# EAGLE design Servo8 (EAGLE 7.6.0)

## Sheet 1 of 2: Adafruit 12-bit 16 channel pwm controller
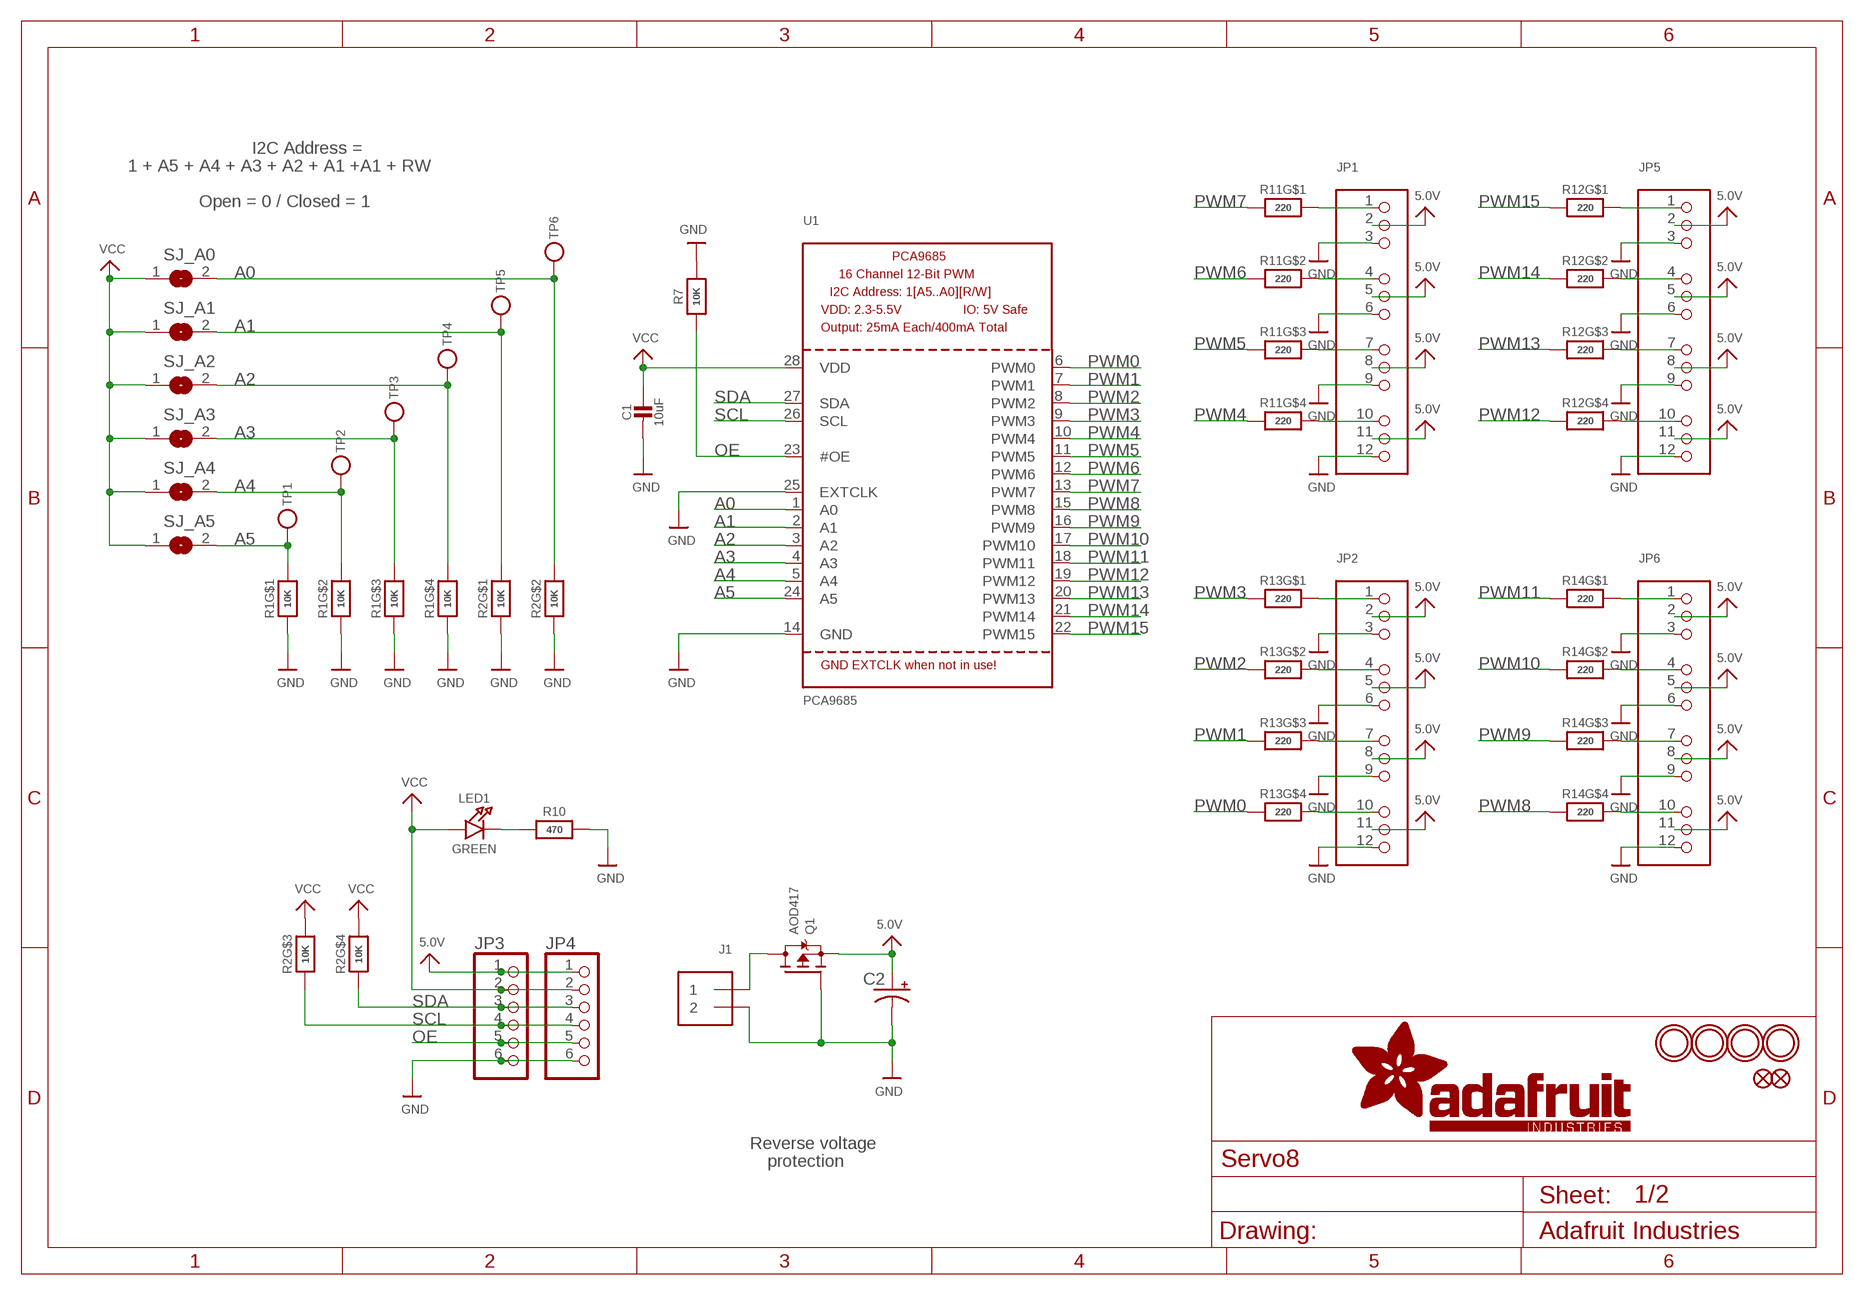
[diagram p0: schematic, sheet 1]

### Parts
C1  10uF  CAP_CERAMIC0805-NOOUTLINE  [0805-NO]
C2  CPOL-USE3.5-8  [E3,5-8]
FID1  FIDUCIAL""  [FIDUCIAL_1MM]
FID2  FIDUCIAL""  [FIDUCIAL_1MM]
J1  TERMBLOCK_1X2  [TERMBLOCK_1X2-3.5MM]
JP1  HEADER-3X04  [3X04]
JP2  HEADER-3X04  [3X04]
JP3  PINHD-1X6CB  [1X06-CLEANBIG]
JP4  PINHD-1X6CB  [1X06-CLEANBIG]
JP5  HEADER-3X04  [3X04]
JP6  HEADER-3X04  [3X04]
LED1  GREEN  LED0805_NOOUTLINE  [CHIPLED_0805_NOOUTLINE]
Q1  AOD417  MOSFET-PTO252  [TO252]
R1  10K  RESISTOR_4PACK  [RESPACK_4X0603]
R2  10K  RESISTOR_4PACK  [RESPACK_4X0603]
R7  10K  RESISTOR0805_NOOUTLINE  [0805-NO]
R10  470  RESISTOR_0805MP  [_0805MP]
R11  220  RESISTOR_4PACK  [RESPACK_4X0603]
R12  220  RESISTOR_4PACK  [RESPACK_4X0603]
R13  220  RESISTOR_4PACK  [RESPACK_4X0603]
R14  220  RESISTOR_4PACK  [RESPACK_4X0603]
SJ_A0  SOLDERJUMPERREFLOW_NOPASTE  [SOLDERJUMPER_REFLOW_NOPASTE]
SJ_A1  SOLDERJUMPERREFLOW_NOPASTE  [SOLDERJUMPER_REFLOW_NOPASTE]
SJ_A2  SOLDERJUMPERREFLOW_NOPASTE  [SOLDERJUMPER_REFLOW_NOPASTE]
SJ_A3  SOLDERJUMPERREFLOW_NOPASTE  [SOLDERJUMPER_REFLOW_NOPASTE]
SJ_A4  SOLDERJUMPERREFLOW_NOPASTE  [SOLDERJUMPER_REFLOW_NOPASTE]
SJ_A5  SOLDERJUMPERREFLOW_NOPASTE  [SOLDERJUMPER_REFLOW_NOPASTE]
TP1  TESTPOINTROUND1MM  [TESTPOINT_ROUND_1MM]
TP2  TESTPOINTROUND1MM  [TESTPOINT_ROUND_1MM]
TP3  TESTPOINTROUND1MM  [TESTPOINT_ROUND_1MM]
TP4  TESTPOINTROUND1MM  [TESTPOINT_ROUND_1MM]
TP5  TESTPOINTROUND1MM  [TESTPOINT_ROUND_1MM]
TP6  TESTPOINTROUND1MM  [TESTPOINT_ROUND_1MM]
U1  PCA9685  [TSSOP28]
U$47  MOUNTINGHOLE2.5  [MOUNTINGHOLE_2.5_PLATED]
U$48  MOUNTINGHOLE2.5  [MOUNTINGHOLE_2.5_PLATED]
U$49  MOUNTINGHOLE2.5  [MOUNTINGHOLE_2.5_PLATED]
U$50  MOUNTINGHOLE2.5  [MOUNTINGHOLE_2.5_PLATED]

### Nets
5.0V: C2.+ JP1.2 JP1.5 JP1.8 JP1.11 JP2.2 JP2.5 JP2.8 JP2.11 JP3.1 JP4.1 JP5.2 JP5.5 JP5.8 JP5.11 JP6.2 JP6.5 JP6.8 JP6.11 Q1.2(S) ; also sheet 2
A0: R2.7 SJ_A0.2 TP6.P$1 U1.1(A0)
A1: R2.8 SJ_A1.2 TP5.P$1 U1.2(A1)
A2: R1.5 SJ_A2.2 TP4.P$1 U1.3(A2)
A3: R1.6 SJ_A3.2 TP3.P$1 U1.4(A3)
A4: R1.7 SJ_A4.2 TP2.P$1 U1.5(A4)
A5: R1.8 SJ_A5.2 TP1.P$1 U1.24(A5)
GND: C1.2 C2.- J1.2 JP1.3 JP1.6 JP1.9 JP1.12 JP2.3 JP2.6 JP2.9 JP2.12 JP3.6 JP4.6 JP5.3 JP5.6 JP5.9 JP5.12 JP6.3 JP6.6 JP6.9 JP6.12 Q1.1(G) R1.1 R1.2 R1.3 R1.4 R2.1 R2.2 R7.2 R10.2 U1.14(GND) U1.25(EXTCLK) ; also sheet 2
N$1: LED1.C R10.1
N$2: JP1.4 R11.7
N$3: JP1.1 R11.8
N$4: JP1.7 R11.6
N$5: JP1.10 R11.5
N$6: JP2.1 R13.8
N$7: JP2.4 R13.7
N$8: JP2.7 R13.6
N$9: JP2.10 R13.5
N$10: JP6.10 R14.5
N$11: JP6.7 R14.6
N$12: JP6.4 R14.7
N$13: JP6.1 R14.8
N$14: JP5.10 R12.5
N$15: JP5.7 R12.6
N$16: JP5.4 R12.7
N$17: JP5.1 R12.8
OE: JP3.5 JP4.5 R7.1 U1.23(#OE)
PWM0: R13.4 U1.6(PWM0)
PWM1: R13.3 U1.7(PWM1) ; also sheet 2
PWM2: R13.2 U1.8(PWM2) ; also sheet 2
PWM3: R13.1 U1.9(PWM3) ; also sheet 2
PWM4: R11.4 U1.10(PWM4) ; also sheet 2
PWM5: R11.3 U1.11(PWM5) ; also sheet 2
PWM6: R11.2 U1.12(PWM6) ; also sheet 2
PWM7: R11.1 U1.13(PWM7) ; also sheet 2
PWM8: R14.4 U1.15(PWM8) ; also sheet 2
PWM9: R14.3 U1.16(PWM9)
PWM10: R14.2 U1.17(PWM10)
PWM11: R14.1 U1.18(PWM11)
PWM12: R12.4 U1.19(PWM12)
PWM13: R12.3 U1.20(PWM13)
PWM14: R12.2 U1.21(PWM14)
PWM15: R12.1 U1.22(PWM15)
PWRIN: J1.1 Q1.3(D)
SCL: JP3.4 JP4.4 R2.3 U1.26(SCL) ; also sheet 2
SDA: JP3.3 JP4.3 R2.4 U1.27(SDA) ; also sheet 2
VCC: C1.1 JP3.2 JP4.2 LED1.A R2.5 R2.6 SJ_A0.1 SJ_A1.1 SJ_A2.1 SJ_A3.1 SJ_A4.1 SJ_A5.1 U1.28(VDD) ; also sheet 2

### Notes on the sheet
- I2C Address =
- 1 + A5 + A4 + A3 + A2 + A1 +A1 + RW
- Open = 0 / Closed = 1
- Reverse voltage
- protection

## Sheet 2 of 2
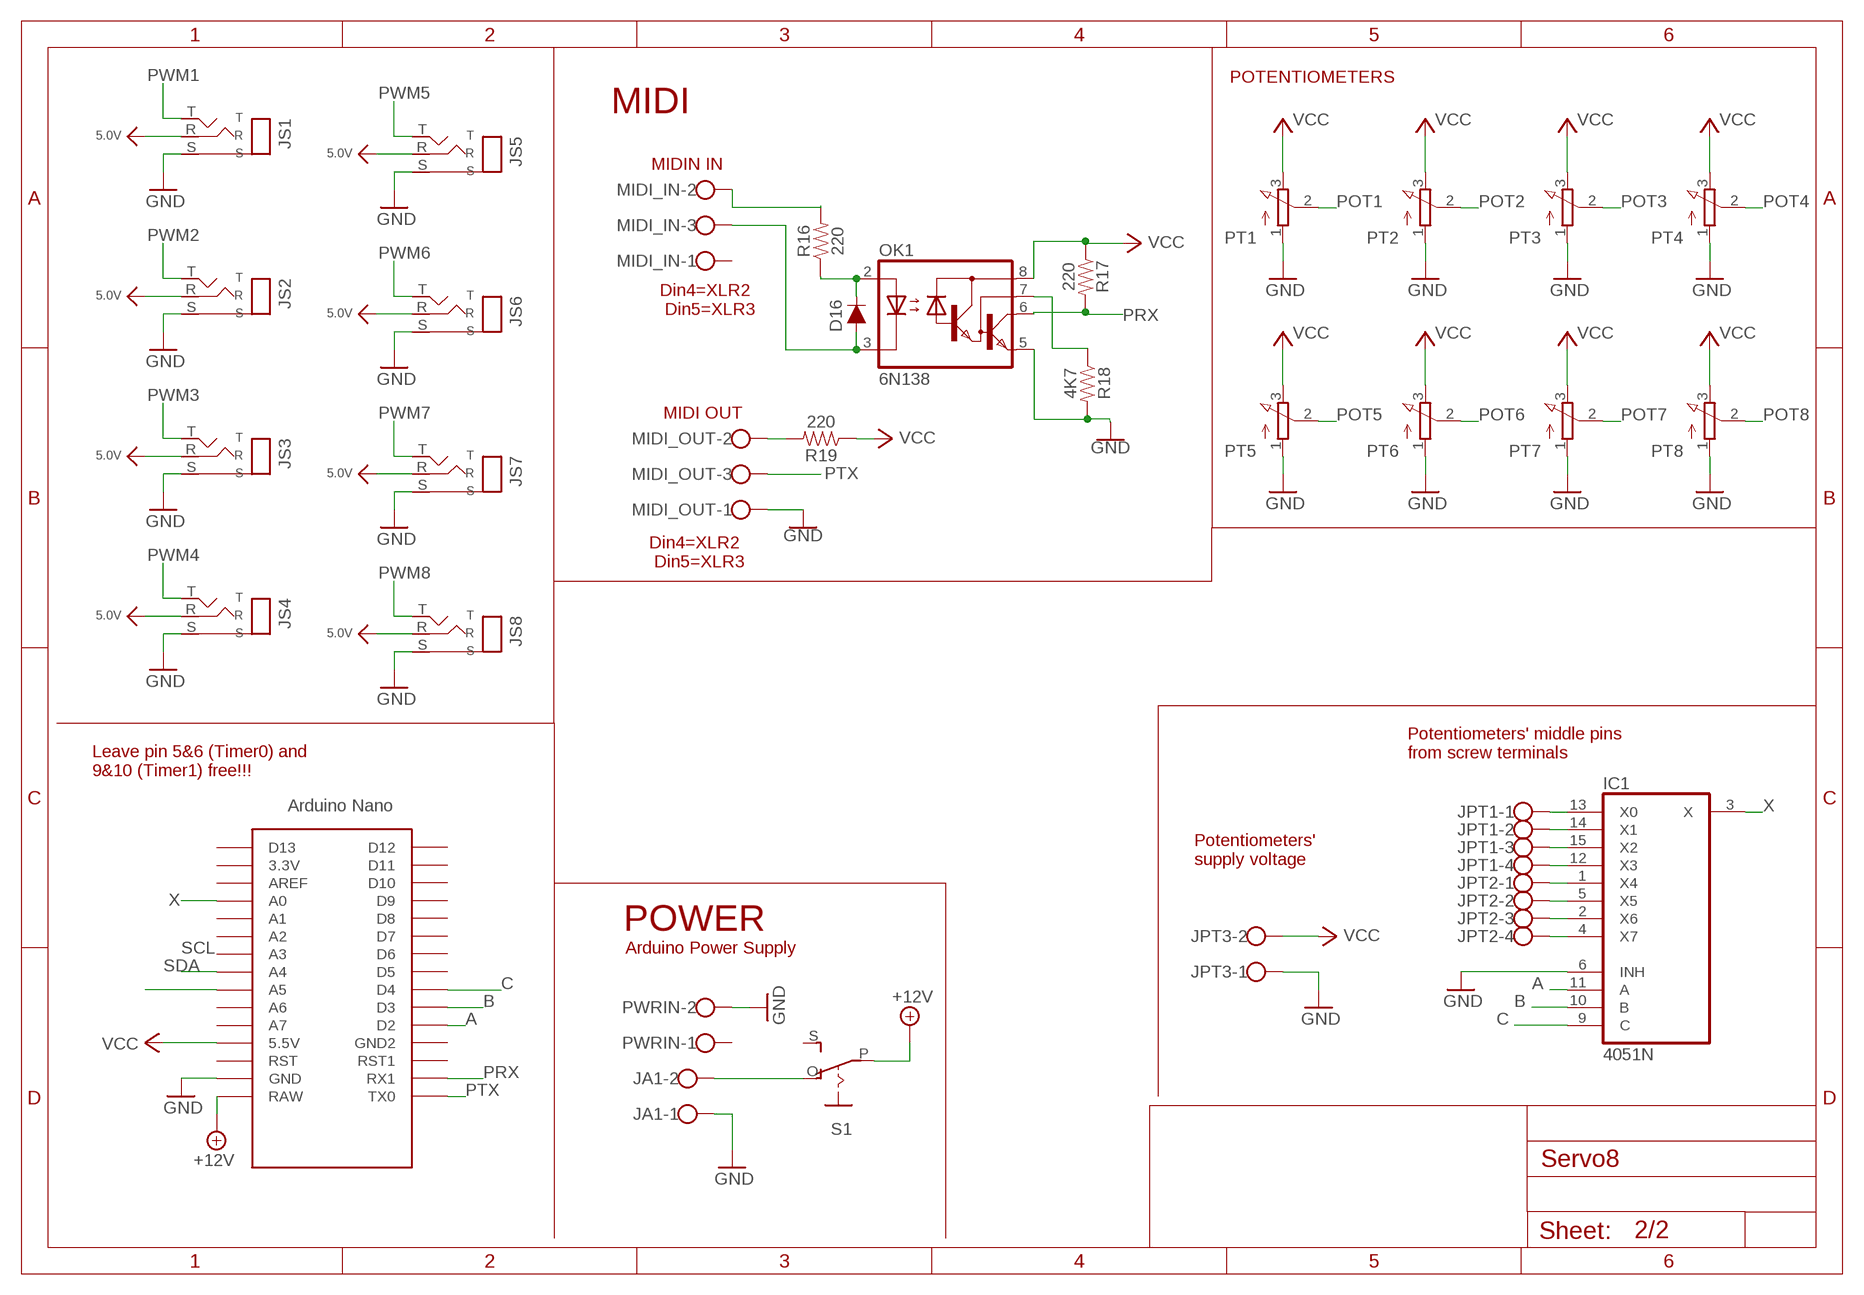
[diagram p1: schematic, sheet 2]

### Parts
D16  200mA/100V/1V  DIODE-1N4148  [DIODE-1N4148]
IC1  4051N  [DIL16]
JA1  W237-102  [W237-102]
JPT1  W237-4  [W237-4]
JPT2  W237-4  [W237-4]
JPT3  W237-102  [W237-102]
JS1  STEREOREV  [STEREO_JACK_MIRROR]
JS2  STEREOREV  [STEREO_JACK_MIRROR]
JS3  STEREOREV  [STEREO_JACK_MIRROR]
JS4  STEREOREV  [STEREO_JACK_MIRROR]
JS5  STEREOREV  [STEREO_JACK_MIRROR]
JS6  STEREOREV  [STEREO_JACK_MIRROR]
JS7  STEREOREV  [STEREO_JACK_MIRROR]
JS8  STEREOREV  [STEREO_JACK_MIRROR]
MIDI_IN  W237-103  [W237-103]
MIDI_OUT  W237-103  [W237-103]
OK1  6N138  [DIL08]
PT1  3RP/1610N  [3RP/1610N]
PT2  3RP/1610N  [3RP/1610N]
PT3  3RP/1610N  [3RP/1610N]
PT4  3RP/1610N  [3RP/1610N]
PT5  3RP/1610N  [3RP/1610N]
PT6  3RP/1610N  [3RP/1610N]
PT7  3RP/1610N  [3RP/1610N]
PT8  3RP/1610N  [3RP/1610N]
PWRIN  W237-4  [W237-4]
R16  220  1KOHM-HORIZ-1/4W-5%  [AXIAL-0.3]
R17  220  1KOHM-HORIZ-1/4W-5%  [AXIAL-0.3]
R18  4K7  1KOHM-HORIZ-1/4W-5%  [AXIAL-0.3]
R19  220  1KOHM-HORIZ-1/4W-5%  [AXIAL-0.3]
S1  EG1218S  [EG1218]
U$55  NANO  [NANO]

### Nets
5.0V: JS1.R JS2.R JS3.R JS4.R JS5.R JS6.R JS7.R JS8.R ; also sheet 1
+12V: S1.P U$55.RAW
A: IC1.11(A) U$55.D2
B: IC1.10(B) U$55.D3
C: IC1.9(C) U$55.D4
GND: IC1.6(INH) JA1.1 JPT3.1 JS1.S JS2.S JS3.S JS4.S JS5.S JS6.S JS7.S JS8.S MIDI_OUT.1 OK1.5(GND) PT1.1(A) PT2.1(A) PT3.1(A) PT4.1(A) PT5.1(A) PT6.1(A) PT7.1(A) PT8.1(A) PWRIN.2 R18.P$2 U$55.GND ; also sheet 1
N$18: JA1.2 S1.O
N$19: MIDI_OUT.2 R19.P$2
N$25: D16.A MIDI_IN.3 OK1.3(C)
N$26: D16.C OK1.2(A) R16.P$1
N$27: MIDI_IN.2 R16.P$2
N$29: OK1.7(VB) R18.P$1
POT1: IC1.13(X0) JPT1.1 PT1.2(S)
POT2: IC1.14(X1) JPT1.2 PT2.2(S)
POT3: IC1.15(X2) JPT1.3 PT3.2(S)
POT4: IC1.12(X3) JPT1.4 PT4.2(S)
POT5: IC1.1(X4) JPT2.1 PT5.2(S)
POT6: IC1.5(X5) JPT2.2 PT6.2(S)
POT7: IC1.2(X6) JPT2.3 PT7.2(S)
POT8: IC1.4(X7) JPT2.4 PT8.2(S)
PRX: OK1.6(VO) R17.P$2 U$55.RX1
PTX: MIDI_OUT.3 U$55.TX0
PWM1: JS1.T ; also sheet 1
PWM2: JS2.T ; also sheet 1
PWM3: JS3.T ; also sheet 1
PWM4: JS4.T ; also sheet 1
PWM5: JS5.T ; also sheet 1
PWM6: JS6.T ; also sheet 1
PWM7: JS7.T ; also sheet 1
PWM8: JS8.T ; also sheet 1
SCL: U$55.A5 ; also sheet 1
SDA: U$55.A4 ; also sheet 1
VCC: JPT3.2 OK1.8(VCC) PT1.3(E) PT2.3(E) PT3.3(E) PT4.3(E) PT5.3(E) PT6.3(E) PT7.3(E) PT8.3(E) R17.P$1 R19.P$1 U$55.5V(5.5V) ; also sheet 1
X: IC1.3(X) U$55.A0
Unconnected: MIDI_IN.1 PWRIN.1 PWRIN.3 PWRIN.4 S1.S U$55.3.3V U$55.A1 U$55.A2 U$55.A3 U$55.A6 U$55.A7 U$55.AREF U$55.D5 U$55.D6 U$55.D7 U$55.D8 U$55.D9 U$55.D10 U$55.D11 U$55.D12 U$55.D13 U$55.GND1(GND2) U$55.ICSP1 U$55.ICSP2 U$55.ICSP3 U$55.ICSP4 U$55.ICSP5 U$55.ICSP6 U$55.RST U$55.RST1

### Notes on the sheet
- POTENTIOMETERS
- MIDI
- MIDIN IN
- Din4=XLR2 
  Din5=XLR3
- MIDI OUT
- Din4=XLR2 
  Din5=XLR3
- Potentiometers' middle pins 
  from screw terminals
- Leave pin 5&6 (Timer0) and 
  9&10 (Timer1) free!!!
- Potentiometers' 
  supply voltage
- POWER
- Arduino Power Supply

## Power pins joined to a net without a drawn wire
GND: IC1.8(GND)
VCC: IC1.16(VCC)
VEE: IC1.7(VEE)

## Library data of the parts
C1 = microbuilder:CAP_CERAMIC: Ceramic Capacitors For new designs, use the packages preceded by an '_' character since they are more reliable: The following footprints should be used on most boards: _0402 - Standard footprint for regular board layouts _0603 - Standard footprint for regular board layouts _0805 - Standard footprint for regular board layouts _1206 - Standard footprint for regular board layouts For extremely tight-pitch boards where space is at a premium, the following 'micro-pitch' footprints can be used (smaller pads, no silkscreen outline, etc.): _0402MP - Micro-pitch footprint for very dense/compact boards _0603MP - Micro-pitch footprint for very dense/compact boards _0805MP - Micro-pitch footprint for very dense/compact boards _1206MP - Micro-pitch footprint for very dense/compact boards
C2 = adafruit:CPOL-US: POLARIZED CAPACITOR, American symbol
D16 = SparkFun-DiscreteSemi:DIODE: Diode These are standard reverse protection diodes and small signal diodes. SparkFun Products: SparkFun SparkPunk Sound Kit <https://www.sparkfun.com/products/11177> SparkFun ESP8266 Thing <https://www.sparkfun.com/products/13231>; PROD_ID: DIO-08378
FID1 FID2 = microbuilder:FIDUCIAL: Fiducial Alignment Points Various fiducial points for machine vision alignment.; BOM: EXCLUDE
IC1 = 40xx:4051: 8-channel ANALOG MULTIPLEXER
J1 = microbuilder:TERMBLOCK_1X2: 3.5mm Terminal block http://www.ladyada.net/library/pcb/eaglelibrary.html
JA1 JPT3 = con-wago-500:W237-102: WAGO SCREW CLAMP; MPN: 237-102; OC_FARNELL: unknown; OC_NEWARK: 70K9898
JP1 JP2 JP5 JP6 = microbuilder:HEADER-3X04
JP3 JP4 = adafruit:PINHD-1X6: PIN HEADER
JPT1 JPT2 PWRIN = con-wago-500:W237-4: WAGO SCREW CLAMP; OC_FARNELL: unknown; OC_NEWARK: unknown
JS1-JS8 = gm-jacks:STEREO: Stereo (TRS) 1/4" Phone Jack often use for the input jack to disconnect battery when there is no plug in the jack also called TRS or tip-ring-sleeve jack
LED1 = microbuilder:LED: LED 0603 - 0603 Surface Mount Package 2mA: Green LED - Low Power (3.9mcd, 2ma, 1.7Vf) - Digikey: 475-2709-2-ND Orange LED - Low Power (9.8mcd, 2ma, 1.8Vf) - Digikey: 475-1194-2-ND Red LED - Low Power (5mcd, 2ma, 1.8Vf) - Digikey: 475-1195-2-ND Yellow LED - Low Power (7mcd, 2ma, 1.8Vf) - Digikey: 475-1196-2-ND 5mA: Blue LED - Low Power (17mcd, 5ma, 2.9Vf) - Digikey: LNJ937W8CRACT-ND 0805 - 0805 Surface Mount Package 2mA: Red LED (8.8mcd, 2mA, 1.8Vf, Clear) - Low Power [Digikey: 475-2510-1-ND] Green LED (5mcd, 2mA, 1.8Vf, Clear) - Low Power [Digikey: 475-2730-1-ND] Yellow LED (11.3mcd, 2mA, 1.8Vf, Clear) - Low Power [Digikey: 475-2555-1-ND] 20mA: Red LED (104mcd, 20mA, Diffused) - LS R976 [Digikey: 475-1278-6-ND] Red LED (12mcd, 20mA, 2.0Vf, Clear) - APT2012EC [Digikey: 754-1128-1-ND] Green LED (15mcd, 20mA, 2.2Vf, Clear) - APT2012GC [Digikey: 754-1131-1-ND] Orange LED (160mcd, 20mA, 2.1Vf, Clear) - APT2012SECK [Digikey: 754-1130-1-ND] 1206 - 1206 Surface Mount Package Green LED (26mcd, 20mA, Diffused) - LG N971 [Digikey: 475-1407-6-ND] Red LED (15mcd, 20mA, Diffused) - LH N974 [Digikey: 475-1416-6-ND] Cree - Cree High-Power Surface Mount LEDs XPEBWT-L1-0000-00D50 - White 111lm 350mA 2.9Vf 6200K 110° XTEAWT-00-0000-00000LEE3 - White 114lm 350mA 2.85Vf 5000K 115° Everlight - Everlight 45-21 Series Surface Mount LEDs 45-21/QK2C-B2832AC2CB2/2T - Warm White 2000mcd 20mA 3.25Vf 3050K 120° 45-21/LK2C-B38452C4CB2/2T - Nuetral White 2000mcd 20mA 3.25Vf 4150K 120° 45-21/LK2C-B50634C6CB2/2T - Cold White 2200mcd 20mA 3.25Vf 5650K 120° PLCC2 Reverse Mount LS T77K-J1L2-1-0-2-R18-Z - Red 11.25mcd 2mA 1.8Vf 630nm 120° LO T77K-L1M2-24-Z - Orange 19.6mcd 2mA 1.8Vf 606nm 120° LY T77K-K2M1-26-Z - Yellow 15.7mcd 2mA 1.8Vf 587nm 120°
MIDI_IN MIDI_OUT = con-wago-500:W237-103: WAGO SCREW CLAMP; MPN: 237-103; OC_FARNELL: unknown; OC_NEWARK: 18M7116
OK1 = optocoupler:6N138: MOTOROLA OPTO COUPLER; MF: VISHAY/TELEFUNKEN; MPN: 6N138; OC_FARNELL: 9860150; OC_NEWARK: 35K5294
PT1-PT8 = pot:3RP/1610N: 16mm Potentiometer one level Source: http://www.alphapotentiometers.net/html/16mm_pot_2.html
Q1 = microbuilder:MOSFET-P: P-Channel Mosfet LEGEND VDS: Voltage Drain-Source ID: Drain Current RDS(ON): Drain-Source On-State Resistance VGS(TH): Gate-Source Threshold Voltage CISS: Drain-Source Input Capacitance SOT-23 Name VDS ID RDS(ON) VGS(TH) CISS Order Number IRLML5103 30V 760mA 600 mOhm -- 75pF @ 25V Digikey: IRLML5103PBFCT-ND IRLML6401 12V 4.3A 50 mOhm 950mV @ 250µA 830pF @ 10V Digikey: IRLML6401PBFTR-ND NTR0202PL 20V 400mA 800 mOhm 2.3V @ 250uA 70pF @ 5V Digikey: NTR0202PLT1GOSTR-ND NTR4101PT1G 20V 1.8A 85 mOhm 1.2V @ 250uA 675pF @ 10V Digikey: NTR4101PT1GOSCT-ND DMP2004K 20V 600mA 900 mOhm 1V @ 250uA 175pF @ 16V Digikey: DMP2004KDICT-ND PMV65XP 20V 3.9A 76 mOhm 950mV @ 1mA 725pF @ 20V Digikey: 568-2358-2-ND TO-252 Name VDS ID RDS(ON) VGS(TH) CISS Order Number AOD417 30V 25A 34 mOhm 3V @ 250µA 920pF @ 15V Digikey: 785-1106-2-ND
R1 R2 R11-R14 = microbuilder:RESISTOR_4PACK: Resistor Packs (4 resistors) 4 x 0603 10K 1/16W - Digikey: YC164J-10KCT-ND
R7 R10 = microbuilder:RESISTOR: Resistors For new designs, use the packages preceded by an '_' character since they are more reliable: The following footprints should be used on most boards: _0402 - Standard footprint for regular board layouts _0603 - Standard footprint for regular board layouts _0805 - Standard footprint for regular board layouts _1206 - Standard footprint for regular board layouts For extremely tight-pitch boards where space is at a premium, the following 'micro-pitch' footprints can be used (smaller pads, no silkscreen outline, etc.): _0402MP - Micro-pitch footprint for very dense/compact boards _0603MP - Micro-pitch footprint for very dense/compact boards _0805MP - Micro-pitch footprint for very dense/compact boards _1206MP - Micro-pitch footprint for very dense/compact boards
R16-R19 = SparkFun-Resistors:1KOHM: 1kΩ resistor A resistor is a passive two-terminal electrical component that implements electrical resistance as a circuit element. Resistors act to reduce current flow, and, at the same time, act to lower voltage levels within circuits. - Wikipedia; PROD_ID: RES-08380; VALUE: 1k
S1 = adafruit:EG1218: SLIDING SWITCH 0.1" spacing through hole, vertical SPDT slide switch http://www.ladyada.net/library/pcb/eaglelibrary.html
SJ_A0 SJ_A1-SJ_A5 = microbuilder:SOLDERJUMPER: SMD Solder JUMPER Solder the two pads together to create a connection, or remove the solder to break it. REFLOW - Use this footprint for solder paste and reflow ovens. WAVE - Use this footprint for hand-soldering (larger pads). CLOSED - Has a trace between the two pads to ensure it is closed by default. The trace needs to be cut to disable the jumper, and can be closed again by creating a solder bridge between the two pads.
TP1-TP6 = microbuilder:TESTPOINT: Test Point Various test points for characterisation and PCB testing TESTPOINT_SMT - Compact Surface Mount Test Point [Digikey: 5016KTR-ND]
U1 = microbuilder:PCA9685: PCA9685 - 16 Channel 12-Bit I2C PWM Controller 5.0V tolerant 16 channel, 12-bit I2C PWM controller with 25mA per output (max. 400mA total) Digikey: 568-5931-1-ND
U$47-U$50 = microbuilder:MOUNTINGHOLE: Mounting Hole For #2 screws (0.086"/2.18mm width, 0.094"/2.4mm hole) use 2.5mm; BOM: EXCLUDE
U$55 = Arduino-clone:NANO: Arduino Nano

## Net classes
0 default: width 0.508 mm, drill 0.508 mm, clearance 0.406 mm
1 GND: width 1.016 mm, drill 0.508 mm, clearance 0.508 mm
2 5VM: width 1.016 mm, drill 0.508 mm, clearance 0.508 mm
3 12VL: width 0.61 mm, drill 0.508 mm, clearance 0.508 mm
4 12VA: width 0.508 mm, drill 0.508 mm, clearance 0.508 mm

## Board
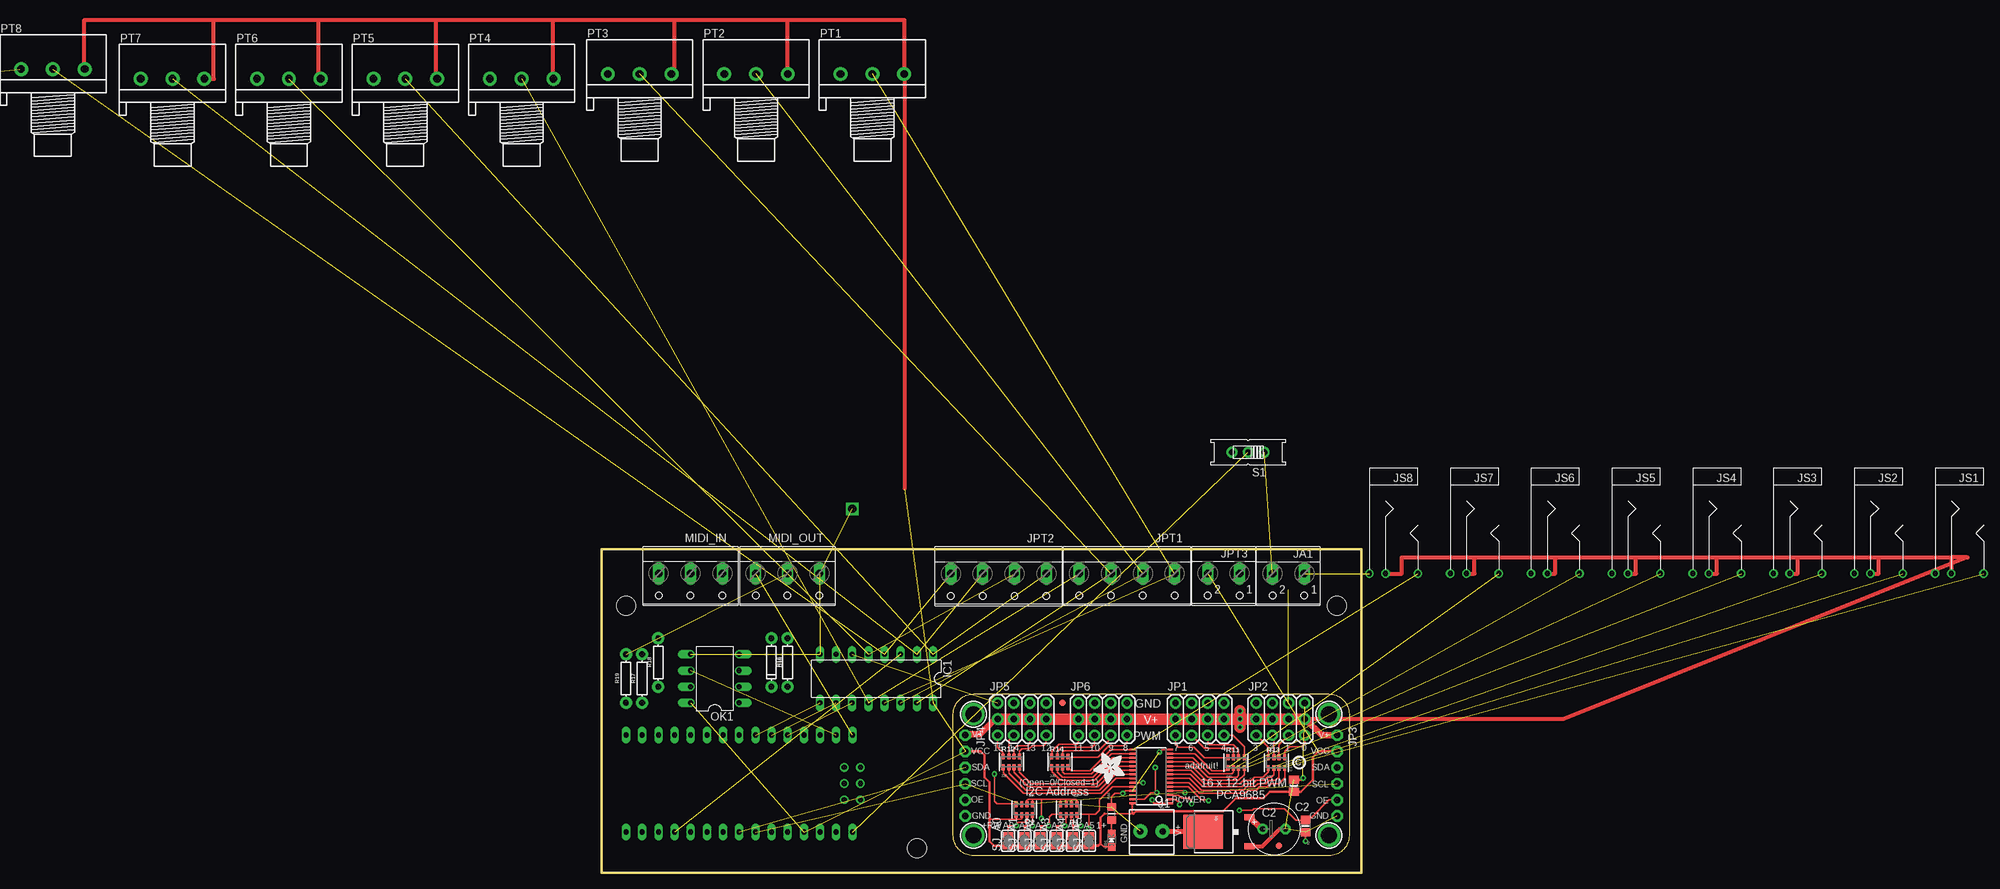
[diagram p2: board, top side]
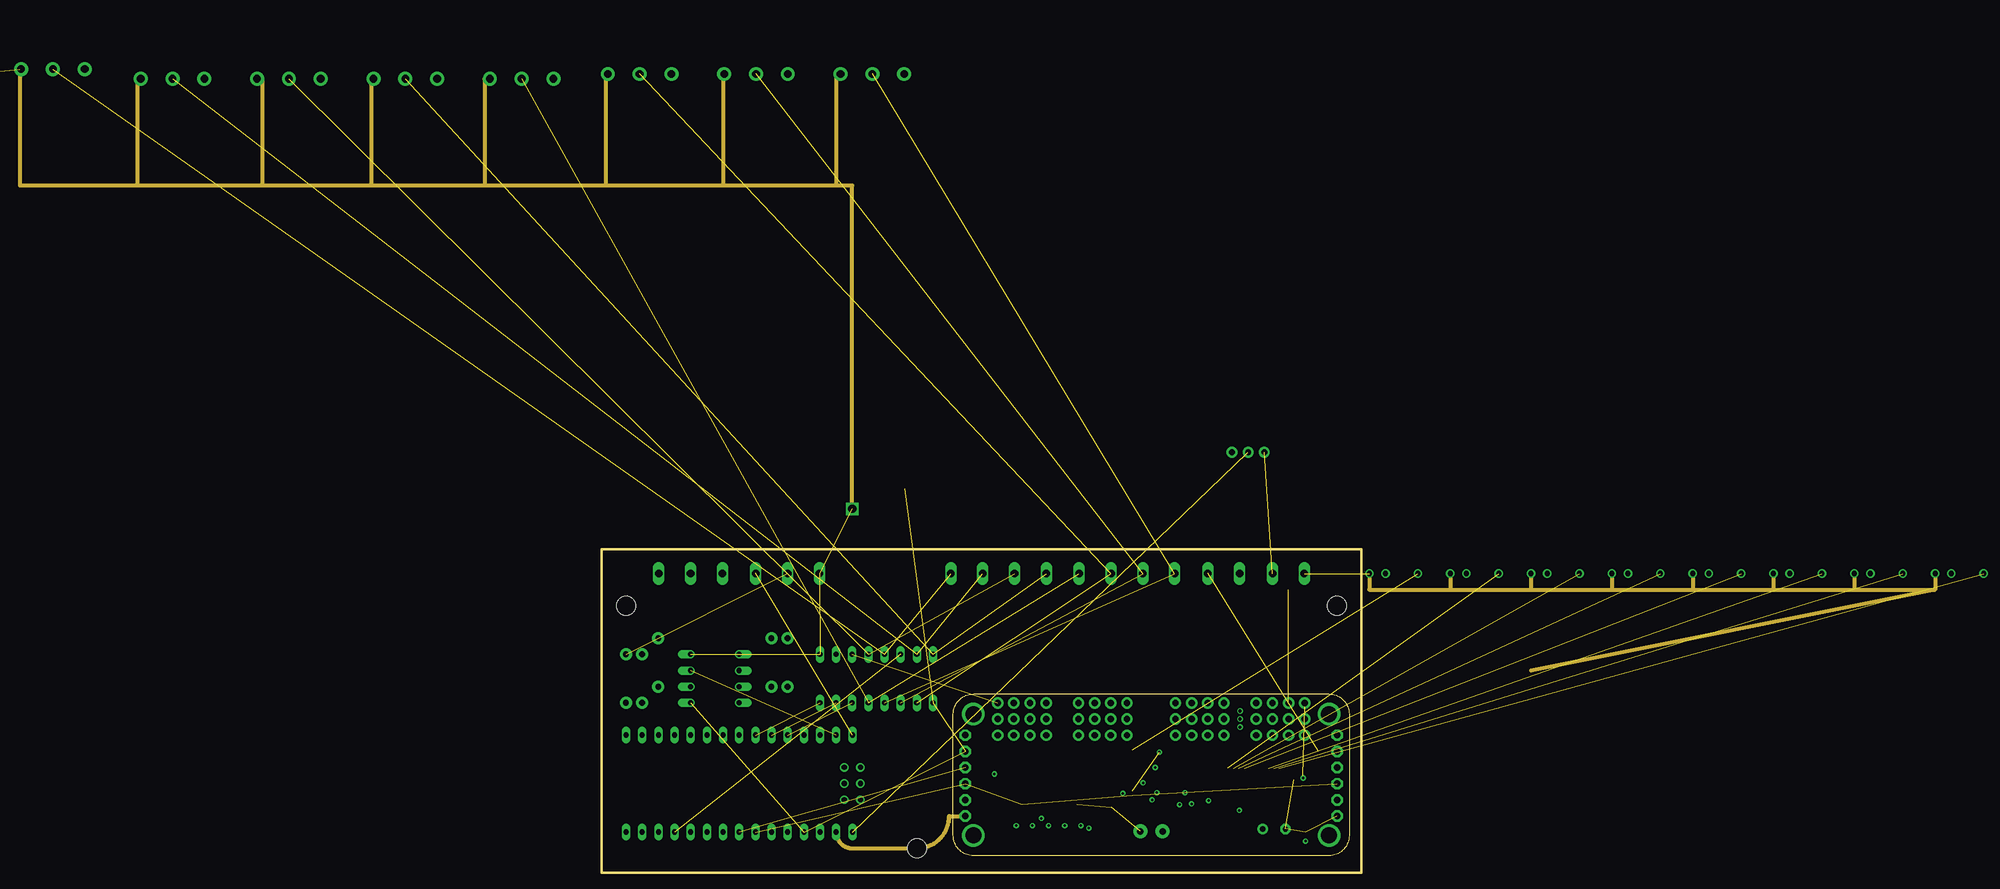
[diagram p3: board, inner layer GND]
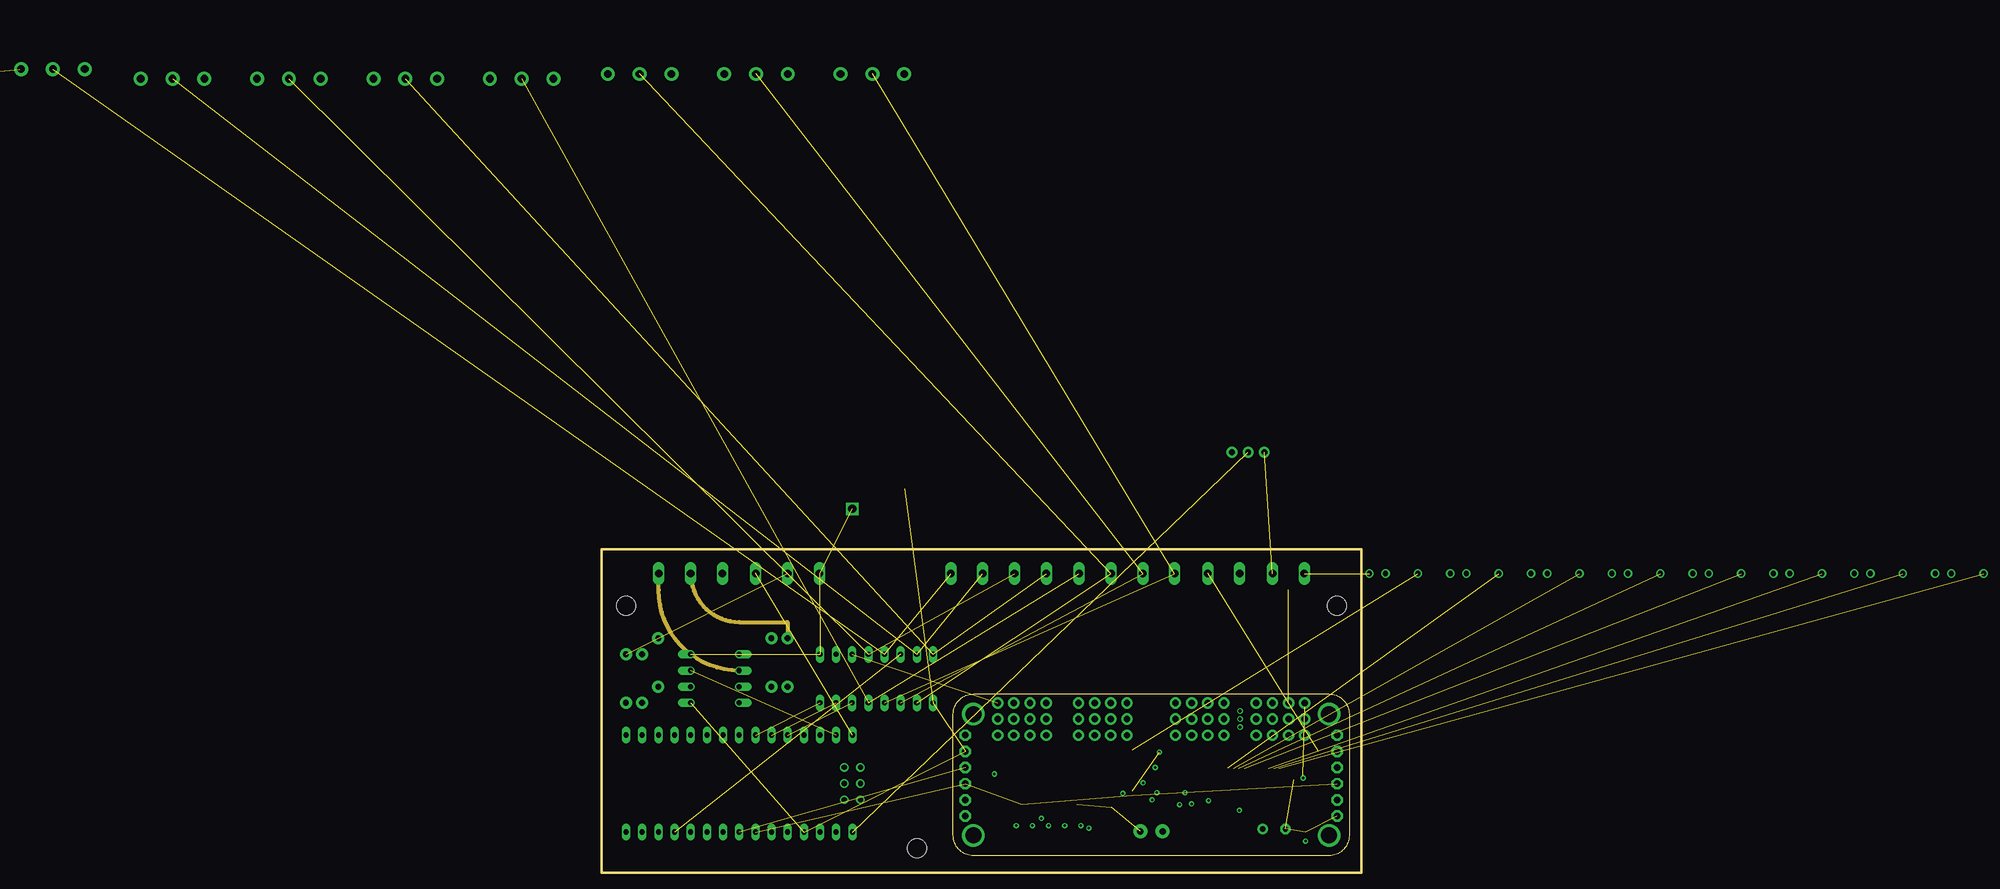
[diagram p4: board, inner layer CON]
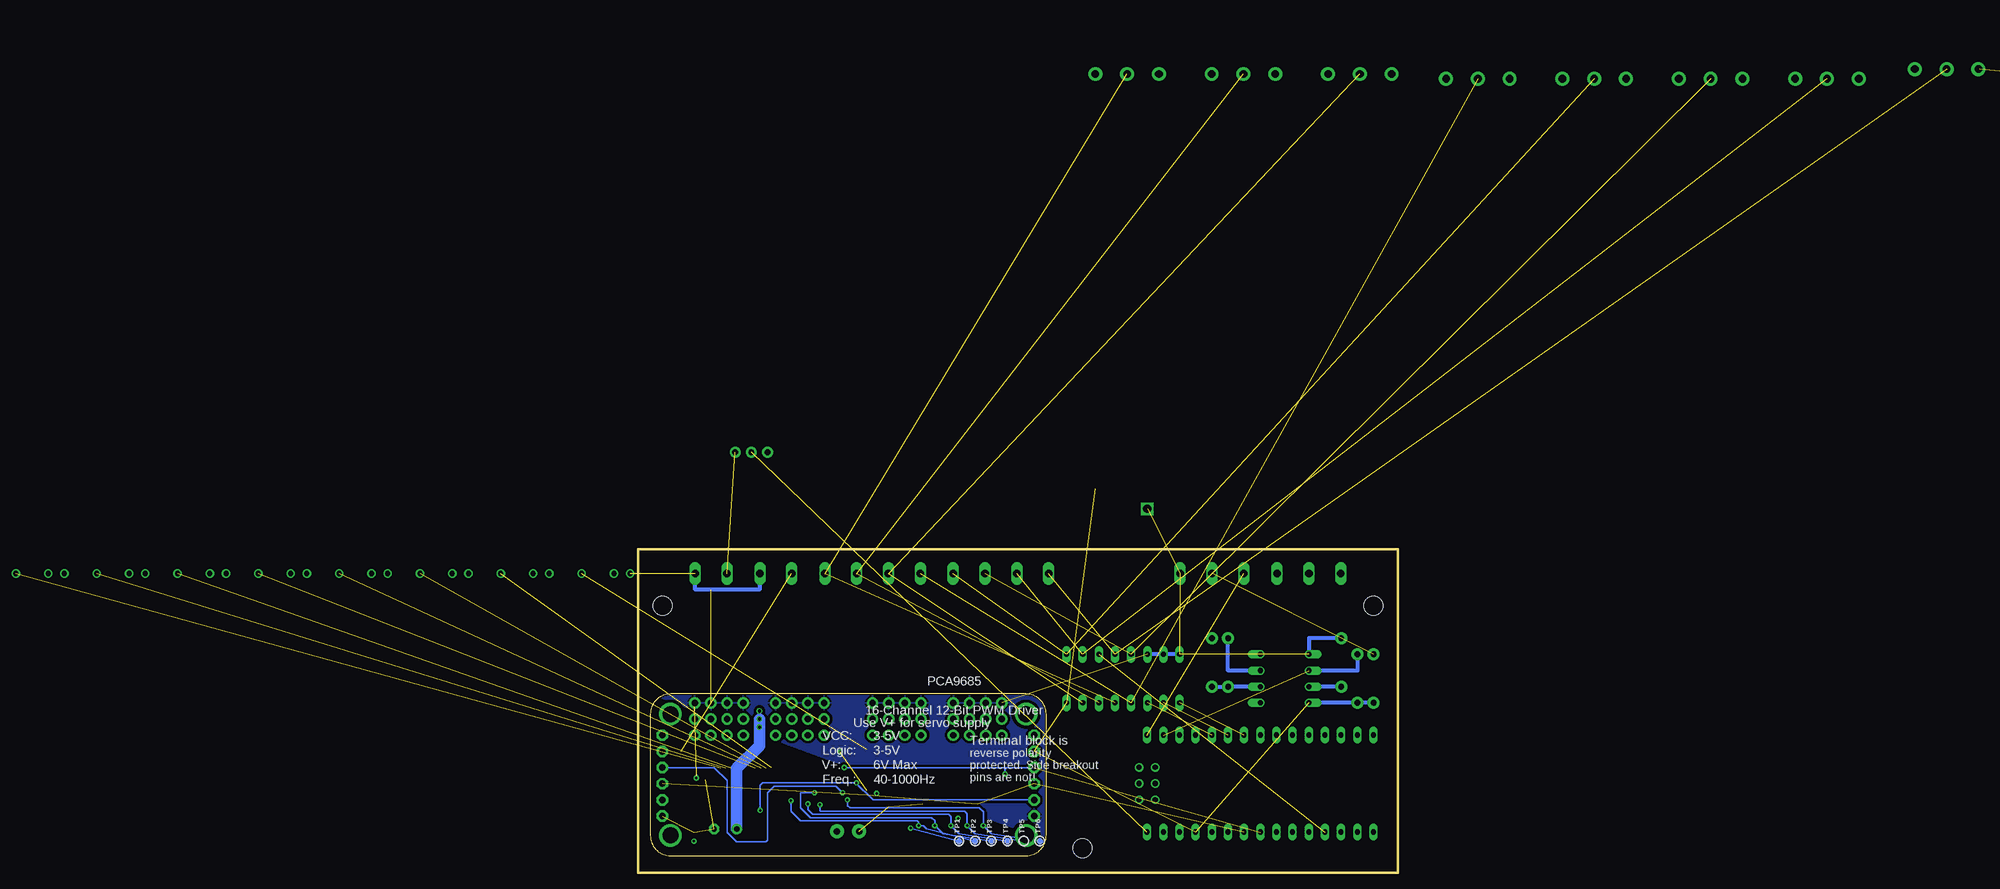
[diagram p5: board, bottom side, seen from below]

Size 119.38 x 50.8 mm. Coordinates in mm from the lower left corner, seen from the top.
Outline: 114.3,28.07 arc-90 117.47,24.89 117.47,5.84 arc-90 114.3,2.67 58.42,2.67 arc-90 55.25,5.84 55.25,24.89 arc-90 58.42,28.07 114.3,28.07
Outline: 0,0 119.38,0 119.38,50.8 0,50.8 0,0
Copper layers (1*2*3*16): Top 0.035mm / dielectric 1.5mm / GND 0.035mm / dielectric 0.15mm / CON 0.035mm / dielectric 0.2mm / Bottom 0.035mm
Design rules "adafruit *": minimum track width 8mil, minimum drill 15.5mil, track to track 8mil, track to pad 8mil, pad to pad 8mil, via to via 8mil, smd to smd 8mil, copper to edge 10mil, drill to drill 8mil, minimum pad ring 10mil, minimum via ring 8mil, stop-mask expansion 2mil, vias tented up to drill 20mil, thermal gap 10mil
Holes 3 mm at 3.81,41.91 49.53,3.81 115.57,41.91

### Footprints (pad centres in the part's own frame; a part is rotated, then mirrored left to right if it is on the bottom)
0805-NO = smd 1.3 x 1.5: 1 -0.95,0; 2 0.95,0
E3,5-8 = drill 0.813 pad 1.6: + -1.778,0 | drill 0.813 pad 1.6 octagon: - 1.778,0
DIODE-1N4148 = drill 0.9 pad 1.88: A -3.81,0; C 3.81,0
FIDUCIAL_1MM = smd 1 x 1: 1 0,0
DIL16 = drill 0.813 long: 1 -8.89,-3.81; 2 -6.35,-3.81; 3 -3.81,-3.81; 4 -1.27,-3.81; 5 1.27,-3.81; 6 3.81,-3.81; 7 6.35,-3.81; 8 8.89,-3.81; 9 8.89,3.81; 10 6.35,3.81; 11 3.81,3.81; 12 1.27,3.81; 13 -1.27,3.81; 14 -3.81,3.81; 15 -6.35,3.81; 16 -8.89,3.81
TERMBLOCK_1X2-3.5MM = drill 1 pad 2.184: 1 1.8,0; 2 -1.7,0
W237-102 = drill 1.194 long: 1 -2.5,-1.27; 2 2.5,-1.27
3X04 = drill 1 pad 1.778: 1 -3.81,-2.54; 2 -3.81,0; 3 -3.81,2.54; 4 -1.27,-2.54; 5 -1.27,0; 6 -1.27,2.54; 7 1.27,-2.54; 8 1.27,0; 9 1.27,2.54; 10 3.81,-2.54; 11 3.81,0; 12 3.81,2.54
1X06-CLEANBIG = drill 1.016 pad 1.778 octagon: 1 -6.35,0; 2 -3.81,0; 3 -1.27,0; 4 1.27,0; 5 3.81,0; 6 6.35,0
W237-4 = drill 1.194 long: 1 -7.5,-1.27; 2 -2.5,-1.27; 3 2.5,-1.27; 4 7.5,-1.27
STEREO_JACK_MIRROR = drill 0.8: R 6.35,-1.27; S 6.35,-3.81; T 6.35,3.81
CHIPLED_0805_NOOUTLINE = smd 1.2 x 1.2: A 0,-1.05; C 0,1.05
W237-103 = drill 1.194 long: 1 -5,-1.29; 2 0,-1.29; 3 5,-1.29
DIL08 = drill 0.813 offset: 1 -3.81,-3.81; 2 -1.27,-3.81; 3 1.27,-3.81; 4 3.81,-3.81; 5 3.81,3.81; 6 1.27,3.81; 7 -1.27,3.81; 8 -3.81,3.81
3RP/1610N = drill 1.2 pad 2.184: 1 -5,0; 2 0,0; 3 5,0
TO252 = smd 1 x 1.6: 1 -2.28,-4.8; 2 2.28,-4.8 | smd 5.4 x 6.2: 3 0,2.5
RESPACK_4X0603 = smd 0.45 x 0.9: 1 -1.3,-0.85; 2 -0.4,-0.85; 3 0.4,-0.85; 4 1.3,-0.85; 5 1.3,0.85; 6 0.4,0.85; 7 -0.4,0.85; 8 -1.3,0.85
_0805MP = smd 1.2 x 1.3: 1 -1.016,0; 2 1.016,0
AXIAL-0.3 = drill 0.9 pad 1.88: P$1 -3.81,0; P$2 3.81,0
EG1218 = drill 0.9 pad 1.676: O -2.54,0; P 0,0; S 2.54,0
SOLDERJUMPER_REFLOW_NOPASTE = smd 1.168 x 1.6: 1 -0.762,0; 2 0.762,0
TESTPOINT_ROUND_1MM = smd 1 x 1: P$1 0,0
TSSOP28 = smd 0.305 x 0.991: 1 -4.225,-2.918; 2 -3.575,-2.918; 3 -2.925,-2.918; 4 -2.275,-2.918; 5 -1.625,-2.918; 6 -0.975,-2.918; 7 -0.325,-2.918; 8 0.325,-2.918; 9 0.975,-2.918; 10 1.625,-2.918; 11 2.275,-2.918; 12 2.925,-2.918; 13 3.575,-2.918; 14 4.225,-2.918; 15 4.225,2.918; 16 3.575,2.918; 17 2.925,2.918; 18 2.275,2.918; 19 1.625,2.918; 20 0.975,2.918; 21 0.325,2.918; 22 -0.325,2.918; 23 -0.975,2.918; 24 -1.625,2.918; 25 -2.275,2.918; 26 -2.925,2.918; 27 -3.575,2.918; 28 -4.225,2.918
MOUNTINGHOLE_2.5_PLATED = drill 2.5 pad 3.2: P$1 0,0
NANO = drill 0.8 long: 3.3V -10.16,24.13; 5V -10.16,-1.27; A0 -10.16,19.05; A1 -10.16,16.51; A2 -10.16,13.97; A3 -10.16,11.43; A4 -10.16,8.89; A5 -10.16,6.35; A6 -10.16,3.81; A7 -10.16,1.27; AREF -10.16,21.59; D2 5.08,1.27; D3 5.08,3.81; D4 5.08,6.35; D5 5.08,8.89; D6 5.08,11.43; D7 5.08,13.97; D8 5.08,16.51; D9 5.08,19.05; D10 5.08,21.59; D11 5.08,24.13; D12 5.08,26.67; D13 -10.16,26.67; GND -10.16,-6.35; GND1 5.08,-1.27; RAW -10.16,-8.89; RST -10.16,-3.81; RST1 5.08,-3.81; RX1 5.08,-6.35; TX0 5.08,-8.89 | drill 0.8: ICSP1 -5.08,-10.16; ICSP2 -5.08,-7.62; ICSP3 -2.54,-10.16; ICSP4 -2.54,-7.62; ICSP5 0,-10.16; ICSP6 0,-7.62

### Placement (x,y rotation side)
C1  108.79,13.65 90 top
C2  105.66,6.86 0 top
D16  26.67,33.02 270 top
FID1  72.41,26.7 180 top
FID2  106.43,4.22 180 top
IC1  43.18,30.48 180 top
J1  86.36,6.48 0 top
JA1  107.92,45.72 180 top
JP1  93.98,24.13 0 top
JP2  106.68,24.13 0 top
JP3  115.57,15.24 270 top
JP4  57.15,15.24 270 top
JP5  66.04,24.13 0 top
JP6  78.74,24.13 0 top
JPT1  82.55,45.72 180 top
JPT2  62.38,45.69 180 top
JPT3  97.74,45.75 180 top
JS1  213.36,53.34 270 top  (outside the outline)
JS2  200.66,53.34 270 top  (outside the outline)
JS3  187.96,53.34 270 top  (outside the outline)
JS4  175.26,53.34 270 top  (outside the outline)
JS5  162.56,53.34 270 top  (outside the outline)
JS6  149.86,53.34 270 top  (outside the outline)
JS7  137.16,53.34 270 top  (outside the outline)
JS8  124.46,53.34 270 top
LED1  80.14,5.08 0 top
MIDI_IN  13.97,45.72 180 top
MIDI_OUT  29.21,45.72 180 top
OK1  17.78,30.48 90 top
PT1  42.55,125.48 0 top  (outside the outline)
PT2  24.26,125.48 0 top  (outside the outline)
PT3  5.97,125.48 0 top  (outside the outline)
PT4  -12.57,124.71 0 top  (outside the outline)
PT5  -30.86,124.71 0 top  (outside the outline)
PT6  -49.15,124.71 0 top  (outside the outline)
PT7  -67.44,124.71 0 top  (outside the outline)
PT8  -86.23,126.24 0 top  (outside the outline)
PWRIN  -124.46,121.92 180 top  (outside the outline)
Q1  97.02,6.41 90 top
R1  73.41,9.91 180 top
R2  66.42,9.91 180 top
R7  110.62,7.3 270 top
R10  80.14,9.27 90 top
R11  99.69,17.27 0 top
R12  64.39,17.4 0 top
R13  106.05,17.27 0 top
R14  72.01,17.4 0 top
R16  29.21,33.02 90 top
R17  6.35,30.48 90 top
R18  8.89,33.02 90 top
R19  3.81,30.48 90 top
S1  101.6,66.04 180 top  (outside the outline)
SJ_A0  63.88,4.98 90 top
SJ_A1  66.42,4.98 90 top
SJ_A2  68.96,4.98 90 top
SJ_A3  71.5,4.98 90 top
SJ_A4  74.04,4.98 90 top
SJ_A5  76.58,4.98 90 top
TP1  68.96,4.95 90 bottom
TP2  66.42,4.95 90 bottom
TP3  63.88,4.95 90 bottom
TP4  61.34,4.95 90 bottom
TP5  58.8,4.95 90 bottom
TP6  56.26,4.95 90 bottom
U1  86.36,15.11 90 top
U$47  114.3,5.84 180 top
U$48  114.3,24.89 180 top
U$49  58.42,5.84 180 top
U$50  58.42,24.89 180 top
U$51  [ADAFRUIT_5MM]  82.17,18.8 180 top
U$54  [PCBFEAT-REV-040]  109.6,17.27 180 top
U$55  30.51,16.54 90 top

### Tracks (layer width: path | path; a pad name or v marks a point on that pad's centre or on a via)
5.0V  (via drill 0.5)
  Top 0.254: JP2.11 110.62,24.13 | JP5.2 61.85,24.13
  Top 0.61: JS8.R 125.73,46.99 125.73,49.53 137.16,49.53 | 137.16,49.53 149.86,49.53 | 149.86,49.53 162.56,49.53 | 162.56,49.53 175.26,49.53 | 175.26,49.53 187.96,49.53 | 187.96,49.53 200.66,49.53 | 200.66,49.53 212.09,49.53 | 109.22,24.13 151.13,24.13 214.63,49.53 212.09,49.53 | JS7.R 137.16,46.99 137.16,49.53 | JS5.R 162.56,46.99 162.56,49.53 | JS6.R 149.86,46.99 149.86,49.53 | JS4.R 175.26,46.99 175.26,49.53 | JS3.R 187.96,46.99 187.96,49.53 | JS2.R 200.66,46.99 200.66,49.53 | 212.09,49.53 JS1.R
  Top 1.016: JP3.1 113.16,21.59 110.62,24.13 | 61.85,24.13 59.44,21.72 57.28,21.72 JP4.1 | Q1.2 103.65,6.86 C2.+
  Top 1.778: JP2.11 109.22,24.13 JP2.8 JP2.5 JP2.2 v100.33,24.13 | v100.33,24.13 JP1.11 JP1.8 JP1.5 JP1.2 JP6.11 JP6.8 JP6.5 JP6.2 JP5.11 JP5.8 JP5.5 JP5.2 | v100.33,24.13 v100.33,22.86 | v100.33,24.13 v100.33,25.4
  Bottom 1.778: C2.+ 103.89,16.38 100.33,19.94 v100.33,24.13
+12V  (1 unrouted)
A  (1 unrouted)
A0  (via drill 0.39)
  Top 0.254: SJ_A0.2 63.88,7.37 v65.15,7.37 65.15,7.49 65.53,7.87 66.55,7.87 66.82,8.15 R2.7 | v86.49,11.43 86.49,11.18 86.78,10.89 U1.1
  Bottom 0.254: v86.49,11.43 86.49,10.54 86.11,10.16 65.79,10.16 65.15,9.52 v65.15,7.37 63.88,6.1 TP6.P$1
A1  (via drill 0.39)
  Top 0.254: SJ_A1.2 66.42,7.37 v67.69,7.37 67.72,7.4 R2.8 | U1.2 90.19,11.54 90.81,10.92 v90.81,10.67
  Bottom 0.254: v90.81,10.67 90.81,9.65 68.07,9.65 67.69,9.27 v67.69,7.37 66.42,6.1 TP5.P$1
A2  (via drill 0.39)
  Top 0.254: SJ_A2.2 68.96,7.37 v70.23,7.37 70.36,7.49 70.36,8.76 70.74,9.14 72.02,9.14 R1.5 | U1.3 90.68,12.19 91.19,11.68 92.33,11.68 92.71,11.3 v92.71,10.79
  Bottom 0.254: v92.71,10.79 92.71,9.91 91.95,9.14 70.61,9.14 70.23,8.76 v70.23,7.37 68.96,6.1 TP4.P$1
A3  (via drill 0.39)
  Top 0.254: SJ_A3.2 71.5,7.37 v72.77,7.37 73.01,7.6 R1.6 | U1.4 91.43,12.84 v91.69,12.57
  Bottom 0.254: v91.69,12.57 93.85,12.57 93.85,10.16 92.33,8.64 73.28,8.64 72.77,8.13 v72.77,7.37 71.5,6.1 TP3.P$1
A4  (via drill 0.39)
  Top 0.254: 74.04,7.37 SJ_A4.2 | v75.31,7.37 74.04,7.37 | U1.5 92.18,13.49 94.23,11.43 95.25,11.43 v95.38,11.3 | 74.04,7.37 74.04,8.13 73.79,8.38 73.79,9.04 R1.7
  Bottom 0.254: v95.38,11.3 95.38,9.65 93.85,8.13 75.56,8.13 75.31,7.87 v75.31,7.37 74.55,7.37 74.04,6.86 TP2.P$1
A5  (via drill 0.39)
  Top 0.254: U1.24 80.29,13.49 78.23,11.43 78.23,9.78 77.6,9.14 76.58,9.14 | SJ_A5.2 v76.58,6.98 76.58,9.14 | 76.58,9.14 74.79,9.14 R1.8
  Bottom 0.254: TP1.P$1 v76.58,6.98
B  (1 unrouted)
C  (1 unrouted)
GND  (via drill 0.39, 1.3)  (14 unrouted)
  Top 0.254: v110.62,4.95 R7.2 | U1.14 88.05,19.34 v87.63,18.92 | U1.25 82.31,12.84 v81.91,12.45 80.65,12.45 80.14,11.94 R10.2 | R1.1 74.71,11.27 74.42,11.56 73.79,11.56 | 73.79,11.56 73.03,11.56 | 73.03,11.56 72.01,11.56 | 72.01,11.56 69.09,11.56 | 69.09,11.56 67.69,11.56 | 67.69,11.56 67.06,11.56 66.8,11.3 66.8,10.77 R2.2 | v69.09,8.51 69.09,11.56 | R2.1 67.72,11.53 67.69,11.56 | R1.2 73.81,11.54 73.79,11.56 | R1.3 73.01,11.54 73.03,11.56 | R1.4 72.11,11.46 72.01,11.56
  Top 0.406: C1.2 109.98,14.6 v110.24,14.86
  Top 0.61: Q1.1 103.83,4.13 106.55,6.86 C2.-
  GND 0.61: JS8.S 120.65,44.45 133.35,44.45 | 133.35,44.45 146.05,44.45 | 146.05,44.45 158.75,44.45 | 158.75,44.45 171.45,44.45 | 171.45,44.45 184.15,44.45 | 184.15,44.45 196.85,44.45 | 196.85,44.45 209.55,44.45 | JS1.S 209.55,44.45 | 209.55,44.45 146.05,31.75 | 110.49,26.04 JP2.12 | JS2.S 196.85,44.45 | JS3.S 184.15,44.45 | JS4.S 171.45,44.45 | JS5.S 158.75,44.45 | JS6.S 146.05,44.45 | JS7.S 133.35,44.45 | PT8.1 -91.44,126.24 -91.44,107.95 -73.03,107.95 | v39.37,57.15 39.37,107.95 36.83,107.95 | 36.83,107.95 19.05,107.95 | 19.05,107.95 0.63,107.95 | 0.63,107.95 -18.41,107.95 | -18.41,107.95 -36.19,107.95 | -36.19,107.95 -53.34,107.95 | -53.34,107.95 -73.03,107.95 | PT7.1 -73.03,124.71 -73.03,107.95 | PT6.1 -53.34,124.71 -53.34,107.95 | PT5.1 -36.19,124.71 -36.19,107.95 | PT4.1 -18.41,124.71 -18.41,107.95 | PT3.1 0.63,125.48 0.63,107.95 | PT2.1 19.05,125.48 19.05,107.95 | PT1.1 36.83,125.48 36.83,107.95 | U$55.GND arc90 39.42,3.81 49.53,3.81 arc90 54.61,8.89 JP4.6
  Bottom 0.254: v81.91,12.45 81.66,12.45
  Bottom 0.406: v110.24,14.86 110.24,15.24
  Bottom 0.61: JPT3.1 100.33,44.47 107.95,44.45 110.42,44.45 JA1.1 | IC1.8 IC1.6 | R18.P$2 13.97,36.83 OK1.5
  pour Bottom (isolate 0.254): 117.47,28.07 47.08,2.13 47.08,28.07
N$1
  Top 0.254: R10.1 LED1.C
N$2
  Top 0.254: JP1.4 94.74,19.56 98.93,19.56 99.31,19.18 99.3,19.16 R11.7
N$3
  Top 0.254: JP1.1 90.17,20.19 90.68,19.68 93.09,19.68 94.74,18.03 98.31,18.03 R11.8
N$4
  Top 0.254: JP1.7 95.25,20.32 95.5,20.07 99.31,20.07 100.09,19.29 R11.6
N$5
  Top 0.254: JP1.10 99.19,21.59 101,19.78 R11.5
N$6
  Top 0.254: JP2.1 104.75,19.71 R13.8
N$7
  Top 0.254: R13.7 105.64,21.35 JP2.4
N$8
  Top 0.254: R13.6 106.45,20.09 JP2.7
N$9
  Top 0.254: R13.5 107.34,19.08 108.08,19.81 109.98,19.81 110.49,20.32 JP2.10
N$10
  Top 0.254: JP6.10 82.55,20.45 82.04,19.94 79.76,19.94 77.98,18.16 73.31,18.16 R14.5
N$11
  Top 0.254: JP6.7 80.01,21.08 78.11,19.18 72.64,19.18 72.39,18.92 72.39,18.27 R14.6
N$12
  Top 0.254: JP6.4 77.47,20.07 77.09,19.68 72.26,19.68 71.63,19.05 71.63,18.27 R14.7
N$13
  Top 0.254: JP6.1 74.93,20.45 74.68,20.19 71.88,20.19 70.74,19.05 70.74,18.28 R14.8
N$14
  Top 0.254: R12.5 65.69,19.08 66.04,19.43 67.18,19.43 67.69,19.94 69.47,19.94 69.85,20.32 JP5.10
N$15
  Top 0.254: R12.6 64.79,19.45 65.28,19.94 66.93,19.94 67.31,20.32 JP5.7
N$16
  Top 0.254: R12.7 63.99,20.81 JP5.4
N$17
  Top 0.254: JP5.1 62.23,19.68 63.09,18.83 R12.8
N$18  (1 unrouted)
N$19  (1 unrouted)
N$25
  CON 0.61: OK1.3 arc-90 8.97,44.37 MIDI_IN.3
  Bottom 0.61: OK1.3 26.67,31.75 D16.A
N$26
  Bottom 0.61: OK1.2 D16.C R16.P$1
N$27
  CON 0.61: MIDI_IN.2 arc90 21.61,39.37 29.21,39.37 R16.P$2
N$29
  Bottom 0.61: R18.P$1 OK1.7
OE  (via drill 0.39)
  Top 0.254: JP3.5 114.3,11.43 111.51,8.64 110.62,8.64 | U1.23 85.05,14.14 v85.09,14.1 | 110.49,8.64 110.62,8.64 | 110.62,8.64 R7.1 109.09,8.25 107.32,10.03 102.49,10.03 102.24,9.78 v100.2,9.78
  Bottom 0.254: JP4.5 82.51,11.43 85.22,14.14 85.05,14.14 v85.09,14.1 99.82,14.1 100.2,13.72 v100.2,9.78
POT1  (2 unrouted)
POT2  (2 unrouted)
POT3  (2 unrouted)
POT4  (2 unrouted)
POT5  (2 unrouted)
POT6  (2 unrouted)
POT7  (2 unrouted)
POT8  (2 unrouted)
PRX  (1 unrouted)
  Bottom 0.61: R17.P$2 6.35,31.75 OK1.6
PTX  (1 unrouted)
PWM0
  Top 0.254: U1.6 92.29,14.14 93.98,12.45 101.09,12.45 101.6,12.95 102.87,12.95 103.38,13.46 104.65,13.46 105.16,13.97 106.43,13.97 107.34,14.89 R13.4
PWM1  (1 unrouted)
  Top 0.254: U1.7 92.4,14.79 94.23,12.95 100.84,12.95 101.35,13.46 102.62,13.46 103.12,13.97 104.39,13.97 104.9,14.48 105.92,14.48 106.45,15 R13.3
PWM2  (1 unrouted)
  Top 0.254: U1.8 92.51,15.44 94.49,13.46 100.58,13.46 101.09,13.97 102.36,13.97 102.87,14.48 104.14,14.48 104.65,14.99 105.28,14.99 105.66,15.37 105.64,15.39 R13.2
PWM3  (1 unrouted)
  Top 0.254: U1.9 92.62,16.09 94.74,13.97 100.33,13.97 100.84,14.48 102.11,14.48 102.62,14.99 103.89,14.99 104.75,15.84 R13.1
PWM4  (1 unrouted)
  Top 0.254: U1.10 92.74,16.74 95,14.48 100.08,14.48 101,15.4 R11.4
PWM5  (1 unrouted)
  Top 0.254: U1.11 92.85,17.39 95.25,14.99 99.82,14.99 100.09,15.26 R11.3
PWM6  (1 unrouted)
  Top 0.254: U1.12 92.96,18.04 95.5,15.49 99.06,15.49 99.3,15.73 R11.2
PWM7  (1 unrouted)
  Top 0.254: U1.13 93.2,18.69 95.88,16 97.92,16 98.4,16.48 R11.1
PWM8  (1 unrouted)
  Top 0.254: U1.15 80.04,19.34 76.71,16 73.86,16 R14.4
PWM9
  Top 0.254: U1.16 80.16,18.69 76.96,15.49 72.77,15.49 72.39,15.88 72.39,16.53 R14.3
PWM10
  Top 0.254: U1.17 80.27,18.04 77.22,14.99 72.39,14.99 71.63,15.75 71.63,16.53 R14.2
PWM11
  Top 0.254: U1.18 80.38,17.39 77.47,14.48 72.14,14.48 70.74,15.88 70.74,16.52 R14.1
PWM12
  Top 0.254: U1.19 80.49,16.74 77.72,13.97 67.44,13.97 65.66,15.75 65.66,16.52 R12.4
PWM13
  Top 0.254: U1.20 80.6,16.09 77.98,13.46 67.06,13.46 64.77,15.75 64.77,16.53 R12.3
PWM14
  Top 0.254: U1.21 80.72,15.44 78.23,12.95 66.67,12.95 64.01,15.62 64.01,16.53 R12.2
PWM15
  Top 0.254: U1.22 80.83,14.79 78.49,12.45 66.29,12.45 63.12,15.62 63.12,16.52 R12.1
PWRIN
  Top 0.813: Q1.3 88.22,6.41 J1.1
SCL  (4 unrouted)
SDA  (via drill 0.39)  (1 unrouted)
  Top 0.254: U1.27 85.33,11.54 86.36,12.57 v87.25,12.57 87,12.83 v87,16.51 | v61.72,15.49 61.72,11.18 62.12,10.78 65.09,10.78 R2.4
  Bottom 0.254: v87,16.51 61.72,16.51 | 61.72,16.51 JP4.3 | JP3.3 107.44,16.51 105.41,14.48 105.41,6.35 103.89,4.83 99.31,4.83 99.06,5.08 99.06,12.57 98.04,13.59 88.27,13.59 v87.25,12.57 | v61.72,15.49 61.72,16.51
VCC  (5 unrouted)
  Top 0.254: 83.57,9.27 78.99,9.27 | R2.6 66.02,8.49 65.91,8.38 65.15,8.38 | 65.15,8.38 61.09,8.38 60.96,8.51 | R2.5 65.12,8.41 65.15,8.38 | LED1.A 78.9,4.03 78.36,4.57
  Top 0.305: 83.44,9.39 U1.28
  Top 0.406: JP3.2 112.65,19.05 111.76,18.16 111.76,14.6 109.86,12.7 C1.1 | 78.99,9.27 78.36,8.64 78.36,4.57 77.98,4.19 76.61,4.19 SJ_A5.1 SJ_A4.1 SJ_A3.1 SJ_A2.1 SJ_A1.1 SJ_A0.1 61.69,4.22 60.96,4.95 60.96,8.51 60.96,14.22 60.2,14.99 60.2,18.41 59.56,19.05 JP4.2 | 83.44,9.39 83.57,9.27 83.95,9.65 97.66,9.65 99.69,11.68 104.01,11.68 105.03,12.7 C1.1 | C1.1
  Top 0.61: PT8.3 -81.28,126.24 -81.28,133.98 -60.96,133.98 | -60.96,133.98 -44.45,133.98 | -44.45,133.98 -26.03,133.98 | -26.03,133.98 -7.62,133.98 | -7.62,133.98 11.43,133.98 | 11.43,133.98 29.21,133.98 | 29.21,133.98 47.55,133.98 PT1.3 47.62,125.48 47.62,60.33 | PT2.3 29.21,125.48 29.21,133.98 | PT3.3 11.43,125.48 11.43,133.98 | PT4.3 -7.62,124.71 -7.62,133.98 | PT5.3 -26.03,124.71 -26.03,133.98 | PT6.3 -44.45,124.71 -44.45,133.98 | PT7.3 -60.96,124.71 -60.96,133.98
  Bottom 0.61: R19.P$1 R17.P$1 OK1.8
X  (1 unrouted)

### Text on the board
tPlace: GND | V+ | V+ | PWM | V+ | 15 | 14 | 13 | 12 | 11 | 10 | 9 | 8 | 7 | 6 | 5 | 4 | 3 | 2 | 1 | 0 | VCC | VCC | adafruit! | SDA | SDA | (Open=0/Closed=1) | 16 x 12-bit PWM | SCL | SCL | I2C Address | PCA9685 | POWER | OE | OE | C2 | GND | GND | +RW | A0 | A1 | A2 | A3 | A4 | A5 | 1+ | GND | V+
bPlace: PCA9685 | 16-Channel 12-Bit PWM Driver | Use V+ for servo supply | 3-5V | VCC: | Terminal block is | 3-5V | Logic: | reverse polarity | protected. Side breakout | 6V Max | V+: | pins are not! | 40-1000Hz | Freq.:
tValues: 10K | 10K | 220 ohm | 220 ohm